# EAGLE design ptvo_fs (EAGLE 9.6.2)
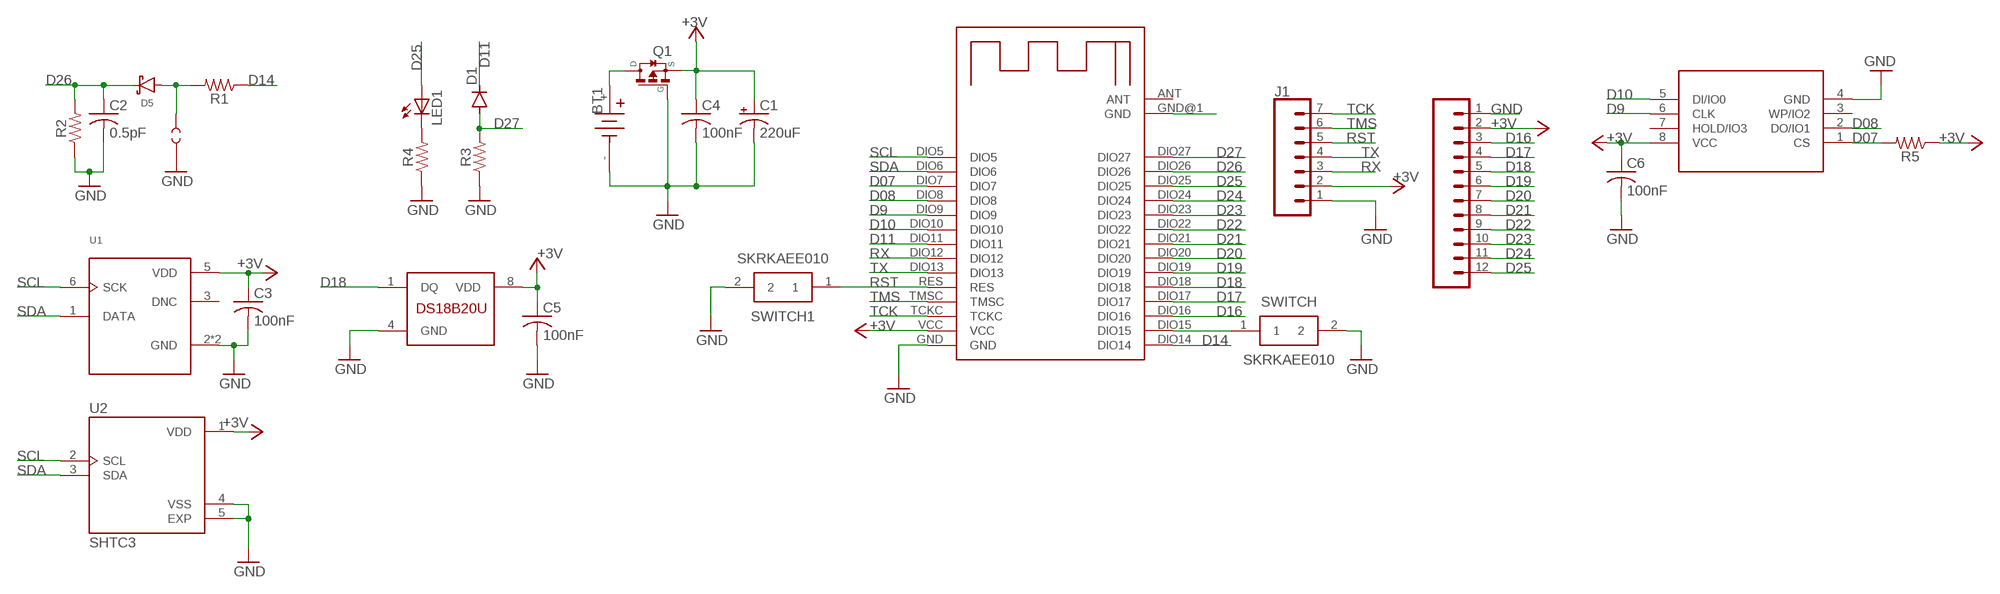
[diagram p0: schematic, sheet 1]

## Parts
BT1  BH2AAAPC  [BAT_BH2AAAPC]
C1  220uF  100UF-POLAR-EIA7343-10V-10%(TANT)  [EIA7343]
C2  0.5pF  C-USC0805  [C0805]
C3  100nF  C-USC0805  [C0805]
C4  100nF  C-USC0805  [C0805]
C5  100nF  C-USC0805  [C0805]
C6  100nF  C-USC0805  [C0805]
D1  PTSMD3528  DIODE-DO214BA  [DO214BA]
D5  1N4148WS  DIODE-SCHOTTKY  [SOD-323]
IC1  DS18S20USOP8  [UMAX8]
J1  CONN_051.27MM  [1X05_1.27MM]
J2  CONN_051.27MM  [1X05_1.27MM]
LED1  LEDCHIP-LED0805  [CHIP-LED0805]
Q1  SI2323DS  [SOT23]
R1  10k  R-US_M0805  [M0805]
R2  1M  R-US_M0805  [M0805]
R3  10k  R-US_M0805  [M0805]
R4  2.2k  R-US_M0805  [M0805]
R5  2.2k  R-US_M0805  [M0805]
SWITCH  SKRKAEE010  [SKRK]
SWITCH1  SKRKAEE010  [SKRK]
TP1  TEST-POINT2  [PAD.02X.02]
TP2  TEST-POINT2  [PAD.02X.02]
U1  HTU21D  [QFN100P300X300X100-7N]
U2  SHTC3  [SON100P200X200X80-5N]
U$1  RF-BM-2652P2  [RF-BM-2652P2]
U$2  IS25LP080D  W25Q80BVSNIG  [SO-8]

## Nets
+3V3: C1.A(+) C3.1 C4.1 C5.1 C6.1 IC1.8(VDD) J1.2 J2.2 Q1.2(S) R5.1 U1.5(VDD) U2.1(VDD) U$1.VCC U$2.8(VCC) ; supply symbol labelled +3V
D07: R5.2 U$1.DIO7 U$2.1(CS)
D08: U$1.DIO8 U$2.2(DO/IO1)
D9: U$1.DIO9 U$2.6(CLK)
D10: U$1.DIO10 U$2.5(DI/IO0)
D11: D1.C U$1.DIO11
D14: R1.1 U$1.DIO14
D16: J2.3 U$1.DIO16
D17: J2.4 U$1.DIO17
D18: IC1.1(DQ) J2.5 U$1.DIO18
D19: J2.6 U$1.DIO19
D20: J2.7 U$1.DIO20
D21: J2.8 U$1.DIO21
D22: J2.9 U$1.DIO22
D23: J2.10 U$1.DIO23
D24: J2.11 U$1.DIO24
D25: J2.12 LED1.A U$1.DIO25
D26: C2.1 D5.C R2.2 U$1.DIO26
D27: D1.A R3.2 U$1.DIO27
GND: BT1.- C1.C(-) C2.2 C3.2 C4.2 C5.2 C6.2 IC1.4(GND) J1.1 J2.1 Q1.1(G) R2.1 R3.1 R4.1 SWITCH1.2 SWITCH.2 TP2.P$1 U1.2(GND) U1.PAD(GND) U2.4(VSS) U2.5(EXP) U$1.GND U$2.4(GND)
N$1: D5.A R1.2 TP1.P$1
N$2: LED1.C R4.2
N$3: SWITCH.1 U$1.DIO15
N$5: BT1.+ Q1.3(D)
N$13: U$1.GND@1(GND)
RST: J1.5 SWITCH1.1 U$1.RES
RX: J1.3 U$1.DIO12
SCL: U1.6(SCK) U2.2(SCL) U$1.DIO5
SDA: U1.1(DATA) U2.3(SDA) U$1.DIO6
TCK: J1.7 U$1.TCKC
TMS: J1.6 U$1.TMSC
TX: J1.4 U$1.DIO13
Unconnected: U1.3(DNC) U$1.ANT U$2.3(WP/IO2) U$2.7(HOLD/IO3)

## Library data of the parts
BT1 = BH2AAAPC:BH2AAAPC: BATTERY HOLDER AAA 2 CELL PC PIN Check availability <https://pricing.snapeda.com/parts/BH2AAAPC/MPD%20%28Memory/view-part?ref=eda>; AVAILABILITY: In Stock; CHECK_PRICES: https://www.snapeda.com/parts/BH2AAAPC/MPD+%2528Memory+Protection+Devices%2529/view-part/?ref=eda; DESCRIPTION: 2 AAA cell holder w/ PC pins nylon plastic; MF: MPD (Memory; MP: BH2AAAPC; PACKAGE: None; PRICE: None; PURCHASE-URL: https://www.snapeda.com/api/url_track_click_mouser/?unipart_id=115930&manufacturer=MPD (Memory&part_name=BH2AAAPC&search_term=aaa battery holder; SNAPEDA_LINK: https://www.snapeda.com/parts/BH2AAAPC/MPD+%2528Memory+Protection+Devices%2529/view-part/?ref=snap
C1 = SparkFun-Capacitors:100UF-POLAR: 100µF polarized capacitors A capacitor is a passive two-terminal electrical component used to store electrical energy temporarily in an electric field.; PROD_ID: CAP-07890; VALUE: 100uF
C2-C6 = adafruit2:C-US: CAPACITOR, American symbol
D1 = diode:DIODE-: DIODE
D5 = pimoroni-passives:DIODE-SCHOTTKY
IC1 = 1wire:DS18S20: High Precision Digital Thermometer This chip provides a onewire thermosensor with approx. 0.5°C accuracy.A programmable over/undertemperure alarm is available. Notes: Vdd must be applied for accurate measurements at low temperatures, as the parasite power circuit otherwise heats the sensor. If parasite power is used, Vdd has to be connected to GND. The DS1822 is a low-cost thermometer chip, the DS18B20 is similar to the DS18S20, but with 9..12 Bit programmable precision. Author: Jan Kandziora <jjj@gmx.de>
J1 = SparkFun-Connectors2:CONN_05: Multi connection point. Often used as Generic Header-pin footprint for 0.1 inch spaced/style header connections On any of the 0.1 inch spaced packages, you can populate with these: Break Away Headers - Straight <https://www.sparkfun.com/products/116> (PRT-00116) Break Away Male Headers - Right Angle <https://www.sparkfun.com/products/553> (PRT-00553) Female Headers <https://www.sparkfun.com/products/115> (PRT-00115) Break Away Headers - Machine Pin <https://www.sparkfun.com/products/117> (PRT-00117) Break Away Female Headers - Swiss Machine Pin <https://www.sparkfun.com/products/743> (PRT-00743) For SCREWTERMINALS and SPRING TERMINALS visit here: Screw Terimnals on SparkFun.com <https://www.sparkfun.com/search/results?term=Screw+Terminals> (5mm/3.5mm/2.54mm spacing) This device is also useful as a general connection point to wire up your design to another part of your project. Our various solder wires solder well into these plated through hole pads. Hook-Up Wire - Assortment (Stranded, 22 AWG) <https://www.sparkfun.com/products/11375> (PRT-11375) Hook-Up Wire - Assortment (Solid Core, 22 AWG) <https://www.sparkfun.com/products/11367> (PRT-11367) View the entire wire category on our website here <https://www.sparkfun.com/categories/141> Special notes: Molex polarized connector foot print use with SKU : PRT-08231 with associated crimp pins and housings. 1MM SMD Version SKU: PRT-10208
J2 = SparkFun-Connectors:CONN_05: Multi connection point. Often used as Generic Header-pin footprint for 0.1 inch spaced/style header connections On any of the 0.1 inch spaced packages, you can populate with these: Break Away Headers - Straight <https://www.sparkfun.com/products/116> (PRT-00116) Break Away Male Headers - Right Angle <https://www.sparkfun.com/products/553> (PRT-00553) Female Headers <https://www.sparkfun.com/products/115> (PRT-00115) Break Away Headers - Machine Pin <https://www.sparkfun.com/products/117> (PRT-00117) Break Away Female Headers - Swiss Machine Pin <https://www.sparkfun.com/products/743> (PRT-00743) For SCREWTERMINALS and SPRING TERMINALS visit here: Screw Terimnals on SparkFun.com <https://www.sparkfun.com/search/results?term=Screw+Terminals> (5mm/3.5mm/2.54mm spacing) This device is also useful as a general connection point to wire up your design to another part of your project. Our various solder wires solder well into these plated through hole pads. Hook-Up Wire - Assortment (Stranded, 22 AWG) <https://www.sparkfun.com/products/11375> (PRT-11375) Hook-Up Wire - Assortment (Solid Core, 22 AWG) <https://www.sparkfun.com/products/11367> (PRT-11367) View the entire wire category on our website here <https://www.sparkfun.com/categories/141> Special notes: Molex polarized connector foot print use with SKU : PRT-08231 with associated crimp pins and housings. 1MM SMD Version SKU: PRT-10208
LED1 = adafruit:LED: LED OSRAM: - CHIPLED LG R971, LG N971, LY N971, LG Q971, LY Q971, LO R971, LY R971 LH N974, LH R974 LS Q976, LO Q976, LY Q976 LO Q996 - Hyper CHIPLED LW Q18S LB Q993, LB Q99A, LB R99A - SideLED LS A670, LO A670, LY A670, LG A670, LP A670 LB A673, LV A673, LT A673, LW A673 LH A674 LY A675 LS A676, LA A676, LO A676, LY A676, LW A676 LS A679, LY A679, LG A679 - Hyper Micro SIDELED® LS Y876, LA Y876, LO Y876, LY Y876 LT Y87S - SmartLED LW L88C, LW L88S LB L89C, LB L89S, LG L890 LS L89K, LO L89K, LY L89K LS L896, LA L896, LO L896, LY L896 - TOPLED LS T670, LO T670, LY T670, LG T670, LP T670 LSG T670, LSP T670, LSY T670, LOP T670, LYG T670 LG T671, LOG T671, LSG T671 LB T673, LV T673, LT T673, LW T673 LH T674 LS T676, LA T676, LO T676, LY T676, LB T676, LH T676, LSB T676, LW T676 LB T67C, LV T67C, LT T67C, LS T67K, LO T67K, LY T67K, LW E67C LS E67B, LA E67B, LO E67B, LY E67B, LB E67C, LV E67C, LT E67C LW T67C LS T679, LY T679, LG T679 LS T770, LO T770, LY T770, LG T770, LP T770 LB T773, LV T773, LT T773, LW T773 LH T774 LS E675, LA E675, LY E675, LS T675 LS T776, LA T776, LO T776, LY T776, LB T776 LHGB T686 LT T68C, LB T68C - Hyper Mini TOPLED® LB M676 - Mini TOPLED Santana® LG M470 LS M47K, LO M47K, LY M47K Source: http://www.osram.convergy.de/
Q1 = SI2323DS:SI2323DS: P-Channel MOSFET; AVAILABILITY: Unavailable; DESCRIPTION: P-Channel 20V 3.7A (Ta) 750mW (Ta) Surface Mount SOT-23-3 (TO-236); MF: Vishay Siliconix; MP: SI2323DS; PACKAGE: SOT-23-3 Vishay Siliconix; PRICE: None
R1-R5 = adafruit4:R-US_: RESISTOR, American symbol
SWITCH SWITCH1 = SPST Round Button:SKRKAEE010: Tactile Switches 3.9x2.9x2.0mm 160gf Packaging Temp 60oC <https://componentsearchengine.com/Images/1/SKRKAEE010.jpg> Source: Datasheet <http://www.mouser.com/ds/2/15/SKRK-1110686.pdf> Check availability <https://pricing.snapeda.com/parts/SKRKAEE010/ALPS/view-part?ref=eda>; AVAILABILITY: Not in stock; CHECK_PRICES: https://www.snapeda.com/parts/SKRKAEE010/ALPS/view-part/?ref=eda; DESCRIPTION: Switch Tactile N.O. SPST Round Button Gull Wing 0.05A 12VDC 1.57N SMD T/R; MF: ALPS; MP: SKRKAEE010; PACKAGE: None; PRICE: None; SNAPEDA_LINK: https://www.snapeda.com/parts/SKRKAEE010/ALPS/view-part/?ref=snap
TP1 TP2 = SparkFun-Connectors:TEST-POINT: SparkFun Test Points Bare copper test points for troubleshooting or In-Circuit-Testing. These are used by our Production team for verifying production board runs using pogo-pins on test beds. SparkFun Products: SparkFun LSM9DS1 Breakout <https://www.sparkfun.com/products/13284> SparkFun PSOC <https://www.sparkfun.com/products/13714> SparkFun Load Cell Amplifier <https://www.sparkfun.com/products/13879>
U1 = HTU21D:HTU21D: Digital Relative Humidity sensor with Temperature output Check prices <https://pricing.snapeda.com/parts/HTU21D/TE%20Connectivity/view-part?ref=eda>; AVAILABILITY: Warning; COMMENT: CAT-HSC0004; DESCRIPTION: Humidity Temperature Sensor 0 ~ 100% RH I²C ±2% RH 5s Surface Mount; MF: TE Connectivity; MP: HTU21D; PACKAGE: DFN-6 TE Connectivity; PRICE: None; PURCHASE-URL: https://pricing.snapeda.com/search/part/HTU21D/?ref=eda
U2 = SHTC3:SHTC3: SENSOR HUMI/TEMP I2C 2% SMD Check availability <https://pricing.snapeda.com/parts/SHTC3/Sensirion%20AG/view-part?ref=eda>; AVAILABILITY: In Stock; DESCRIPTION: SENSOR HUMI/TEMP I2C 2% SMD; MF: Sensirion AG; MP: SHTC3; PACKAGE: DFN-4 Sensirion; PRICE: None; PURCHASE-URL: https://pricing.snapeda.com/search/part/SHTC3/?ref=eda
U$1 = E72-2G4M20S1E:RF-BM-2652P2
U$2 = W25Q80BVSNIG:W25Q80BVSNIG: Check availability <https://pricing.snapeda.com/parts/W25Q80BVSNIG/Winbond%20Electronics/view-part?ref=eda>; AVAILABILITY: In Stock; DESCRIPTION: FLASH - NOR Memory IC 8Mb (1M x 8) SPI - Quad I/O 104 MHz 8-SOIC; MF: Winbond Electronics; MP: W25Q80BVSNIG; PACKAGE: SOIC-8 Winbond; PRICE: None

## Board
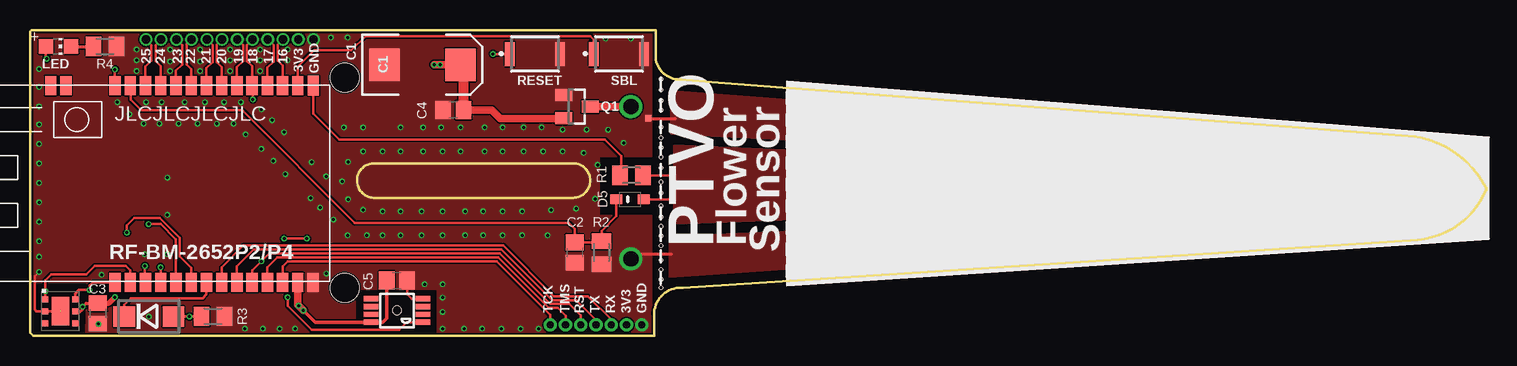
[diagram p1: board, top side]
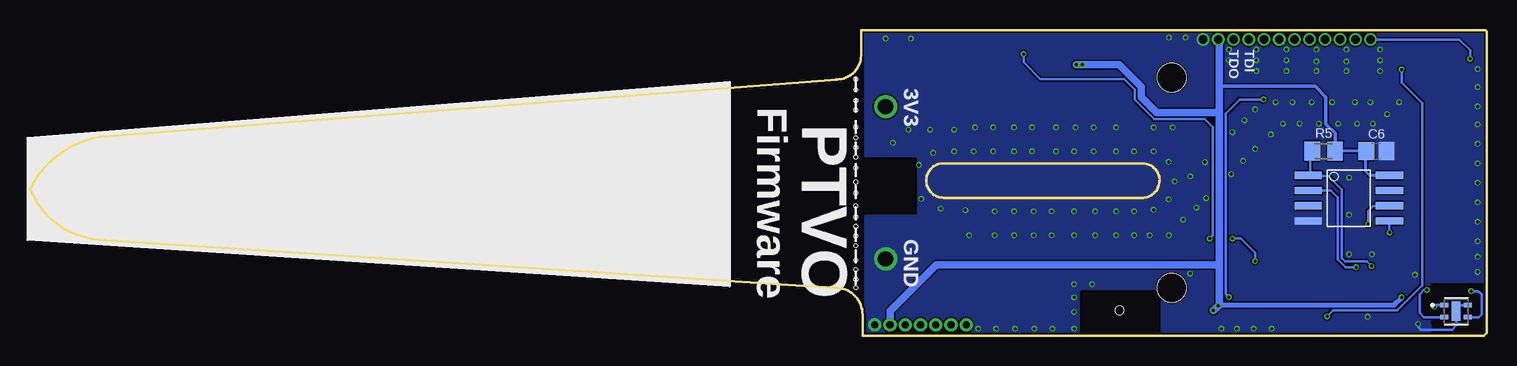
[diagram p2: board, bottom side, seen from below]

Size 121.38 x 25.5 mm. Coordinates in mm from the lower left corner, seen from the top.
Outline: 54.25,21.38 54.12,21.38
Outline: 54.12,21.38 arc-90 52.12,23.38 52.12,25.5 0.12,25.5 0,25.38 0,0.25 0.25,0 52,0 52,1.75 arc-90 54.25,4 54.38,4 115.62,8 arc64 121.38,12.25 arc55 115.38,16.62 54.12,21.38
Copper layers (1*16): Top 0.035559375mm / dielectric 0.17018125mm / Bottom 0.035559375mm
Design rules "oshpark-4layer *": minimum track width 6mil, minimum drill 0.2mm, track to track 5mil, track to pad 5mil, pad to pad 5mil, via to via 5mil, smd to smd 5mil, copper to edge 0.16mm, drill to drill 0.2mm, minimum pad ring 4mil, minimum via ring 4mil, stop-mask expansion 0.05588125mm, vias tented up to drill 50mil, thermal gap 10mil
Holes 0.3 mm at 52.58,4 52.58,4.7 52.58,5.5 52.58,6.3 52.58,7.5 52.58,8.3 52.58,9.1 52.58,9.9 52.58,10.8 52.58,11.9 52.58,12.8 52.58,14 52.58,14.9 52.58,15.7 52.58,16.5 52.58,17.4 52.58,18.8 52.58,19.6 52.58,20.5 52.58,21.4
Holes 0.7 mm at 30.58,2.1
Milling: 4 lines

### Footprints (pad centres in the part's own frame; a part is rotated, then mirrored left to right if it is on the bottom)
BAT_BH2AAAPC = drill 1.27: + 24.05,-6.35; - 24.05,6.35 | hole 2.37: 0.2,8.765; 0.2,-8.765
EIA7343 = smd 2.55 x 2.7: A 3.17,0; C -3.17,0
C0805 = smd 1.3 x 1.5: 1 -0.85,0; 2 0.85,0
DO214BA = smd 1.8 x 1.7: A 2.05,0; C -2.05,0
SOD-323 = smd 1 x 0.8: A 1.15,0; C -1.15,0
UMAX8 = smd 0.45 x 1.2: 1 -0.975,-2.175; 2 -0.325,-2.175; 3 0.325,-2.175; 4 0.975,-2.175; 5 0.975,2.175; 6 0.325,2.175; 7 -0.325,2.175; 8 -0.975,2.175
1X05_1.27MM = drill 0.6 pad 1.1: 1 0,0; 2 1.27,0; 3 2.54,0; 4 3.81,0; 5 5.08,0; 6 6.35,0; 7 7.62,0
1X05_1.27MM' = drill 0.7 pad 1: 1 0,0; 2 1.27,0; 3 2.54,0; 4 3.81,0; 5 5.08,0; 6 6.35,0; 7 7.62,0; 8 8.89,0; 9 10.16,0; 10 11.43,0; 11 12.7,0; 12 13.97,0
CHIP-LED0805 = smd 1.2 x 1.2: A 0,-1.05; C 0,1.05
SOT23 = smd 1 x 1.4: 1 -0.95,-1.1; 2 0.95,-1.1; 3 0,1.1
M0805 = smd 1.3 x 1.6: 1 -0.95,0; 2 0.95,0
SKRK = smd 0.8 x 2: 1 -2.1,0; 2 2.1,0
PAD.02X.02 = smd 0.508 x 0.508: P$1 0,0
QFN100P300X300X100-7N = smd 0.5 x 0.5: 1 -1.25,1; 2 -1.25,0; 3 -1.25,-1; 4 1.25,-1; 5 1.25,0; 6 1.25,1 | smd 1.45 x 2.4: PAD 0.013,0.002
SON100P200X200X80-5N = smd 0.75 x 0.35: 1 -0.97,0.5; 2 -0.97,-0.5; 3 0.97,-0.5; 4 0.97,0.5 | smd 0.7 x 1.6: 5 0,0
RF-BM-2652P2 = smd 1.6 x 0.94: ANT 16.346,23.27; DIO5 -0.073,17.91; DIO6 -0.073,16.64; DIO7 -0.073,15.37; DIO8 -0.073,14.1; DIO9 -0.073,12.83; DIO10 -0.073,11.56; DIO11 -0.073,10.29; DIO12 -0.073,9.02; DIO13 -0.073,7.75; DIO14 16.346,1.4; DIO15 16.346,2.67; DIO16 16.346,3.94; DIO17 16.346,5.21; DIO18 16.346,6.48; DIO19 16.346,7.75; DIO20 16.346,9.02; DIO21 16.346,10.29; DIO22 16.346,11.56; DIO23 16.346,12.83; DIO24 16.346,14.1; DIO25 16.346,15.37; DIO26 16.346,16.64; DIO27 16.346,17.91; GND -0.073,1.4; GND@1 16.346,22; RES -0.073,6.48; TCKC -0.073,3.94; TMSC -0.073,5.21; VCC -0.073,2.67
SO-8 = smd 2.286 x 0.61: 1 -3.378,1.27; 2 -3.378,0; 3 -3.378,-1.27; 4 -3.378,-2.54; 5 3.378,-2.54; 6 3.378,-1.27; 7 3.378,0; 8 3.378,1.27

### Placement (x,y rotation side)
BT1  26.03,12.75 180 bottom
C1  32.7,22.6 0 top
C2  45.38,6.92 270 top
C3  5.65,1.85 270 top
C4  35.27,18.8 180 top
C5  30.58,4.6 0 top
C6  9.17,15.4 0 bottom
D1  9.9,1.6 0 top
D5  50,11.38 0 top
IC1  30.58,2.1 90 top
J1  50.98,0.9 180 top
J2  [1X05_1.27MM']  23.62,24.7 180 top
LED1  2.38,24.12 270 top
Q1  45.58,19.1 270 top
R1  50.12,13.38 0 top
R2  47.62,6.92 90 top
R3  15.25,1.6 180 top
R4  6.25,24.12 180 top
R5  13.57,15.4 180 bottom
SWITCH  49.08,23.5 0 top
SWITCH1  42.08,23.5 0 top
TP1  51.25,13.38 0 top
TP2  51.52,18.12 0 top
U1  2.52,2.04 0 top
U2  2.54,2.04 0 bottom
U$1  24.99,4.51 90 top
U$2  11.47,12.1 0 bottom

### Tracks (layer width: path | path; a pad name or v marks a point on that pad's centre or on a via)
+3V3  (via drill 0.25)
  Top 0.254: C3.1 4.67,2.7 v4.38,2.4 4.38,2.2 4.22,2.04 U1.5
  Top 0.305: v22.78,2.1 23.75,1.12 IC1.8 28.43,1.1 29.38,1.1 29.73,1.45 C5.1
  Top 0.406: C3.1 6.57,2.7 v7.07,3.2
  Top 0.61: Q1.2 44.43,18.1 39.18,18.1 38.48,18.8 C4.1 | C1.A 36.18,22.3 | C1.A v34.18,22.6 v33.68,22.6 | U$1.VCC 22.32,2.55 v22.38,2.5 v22.78,2.1 | C1.A 36.12,22.35
  Top 0.813: C4.1 36.12,22.75 36.27,22.9 36.18,22.9 C1.A
  Bottom 0.254: R5.1 C6.1 10.07,15.35 10.07,13.7 9.74,13.37 U$2.8 | U2.1 4.24,2.54 v4.38,2.4
  Bottom 0.305: R5.1 12.62,16.91 13.38,17.66 13.38,19.91 14.28,20.8 22.28,20.8
  Bottom 0.406: v22.38,2.5 22.32,2.55 7.72,2.55 v7.07,3.2
  Bottom 0.61: J2.2 22.28,24.62 22.28,20.8 22.28,18.7 | 22.28,5.9 22.28,2.58 22.75,2.1 v22.78,2.1 | 22.28,5.9 22.28,18.7 | 22.28,18.7 22.38,18.6 27.48,18.6 28.78,19.9 28.78,20.75 30.62,22.6 v34.18,22.6 | 22.28,5.9 45.88,5.9 49.7,2.07 J1.2
D07  (via drill 0.25)
  Top 0.2: U$1.DIO7 9.57,4.49 v9.57,5.8
  Bottom 0.2: v9.57,5.8 9.97,6.2 11.78,6.2 12.07,6.5 12.07,12.2 13.17,13.3 14.67,13.3 | U$2.1 14.78,13.3 14.67,13.3 | R5.2 14.67,15.25 14.67,13.3
D08  (via drill 0.25)
  Top 0.2: U$1.DIO8 10.89,5.68 v10.88,5.7
  Bottom 0.2: v10.88,5.7 11.74,5.7 12.4,6.37 12.4,11.53 12.97,12.1 U$2.2
D9  (via drill 0.25)
  Top 0.2: U$1.DIO9 12.16,8.01 10.88,9.3 v9.88,9.3
  Bottom 0.2: U$2.6 9.45,10.83 9.88,10.4 v9.88,9.3
D10  (via drill 0.25)
  Top 0.2: U$1.DIO10 13.43,5.64 12.49,6.59 12.49,8.15 10.81,9.83 8.7,9.83 8.07,9.2 v8.07,8.6
  Bottom 0.2: U$2.5 8.1,8.62 v8.07,8.6
D11
  Top 0.203: D1.C 7.85,2.58 8.38,3.1 14.38,3.1 14.7,3.43 U$1.DIO11
D14
  Top 0.2: R1.1 49.25,13.45 49.25,15 47.88,16.38 25.75,16.38 23.59,18.53 U$1.DIO14
D16
  Top 0.2: U$1.DIO16 21.05,22.52 20.65,22.93 20.65,24.27 J2.3
D17
  Top 0.2: U$1.DIO17 19.78,22.36 20.3,22.88 20.3,24.21 J2.4
D18  (via drill 0.25)
  Top 0.2: J2.5 18.08,24.23 18.08,22.9 18.51,22.46 U$1.DIO18 18.58,20.8 v18.58,19.7 | v21.48,3.2 21.48,2.5 23.48,0.5 30.78,0.5 31.4,1.12 IC1.1
  Bottom 0.2: v18.58,19.7 20.58,19.7 21.74,18.53 21.74,3.47 v21.48,3.2
D19
  Top 0.2: U$1.DIO19 17.24,22.39 17.75,22.9 17.75,24.23 J2.6
D20
  Top 0.2: U$1.DIO20 15.97,22.4 15.58,22.8 15.58,24.27 J2.7
D21
  Top 0.2: U$1.DIO21 14.7,22.3 15.22,22.82 15.22,24.21 J2.8
D22
  Top 0.2: 13.07,22.6 13.07,24.31 J2.9
  Top 0.203: U$1.DIO22 13.43,22.24 13.07,22.6
D23
  Top 0.2: 12.67,22.6 12.67,24.22 J2.10
  Top 0.203: U$1.DIO23 12.16,22.09 12.67,22.6
D24
  Top 0.2: 10.47,22.9 10.47,24.25 J2.11
  Top 0.203: U$1.DIO24 10.89,22.48 10.47,22.9
D25  (via drill 0.25)
  Top 0.2: U$1.DIO25 9.62,22.45 10.11,22.93 10.11,24.25 J2.12 | LED1.A 1.33,23.15 v1.38,23.1
  Bottom 0.2: v1.38,23.1 1.38,23.8 2.27,24.7 J2.12
D26
  Top 0.2: 48.83,11.4 D5.C 48.85,9.97 47.62,8.75 R2.2 47.52,7.78 C2.1 45.38,8.9 44.88,9.4 27.08,9.4 17.68,18.8 9.28,18.8 8.38,19.7 8.38,20.84 U$1.DIO26
D27  (via drill 0.25)
  Top 0.2: U$1.DIO27 v7.07,22.2
  Top 0.203: R3.2 v13.28,1.6 D1.A
  Bottom 0.203: v7.07,22.2 7.07,21.1 5.38,19.4 5.38,4.2 7.46,2.12 12.76,2.12 v13.28,1.6
GND  (via drill 0.25)  (1 unrouted)
  Top 0.2: IC1.4 31.8,3.08 31.43,3.45 C5.2 | v0.75,5.3 0.38,4.92 0.38,2.2 0.53,2.04 U1.2 U1.PAD U2.5
  Top 0.254: 53.77,18.1 53.75,18.12 TP2.P$1 | BT1.- 50.48,6.8 53.48,6.8
  Bottom 0.2: U2.4 2.34,2.54 2.54,2.34 U2.5 | U2.5 2.44,1.94 U2.5 | U2.5 2.54,0.84 2.88,0.5 5.47,0.5 5.7,0.73 v5.7,0.98
  other vias: 29.38,10.38 30.88,10.38 32.62,10.38 34.38,10.38 36.25,10.38 37.75,10.38 39.38,10.38 41,10.38 43.43,10.47 27.75,10.5 26.5,11.38 26,12.88 26.5,14.5 27.75,15.38 29.38,15.38 30.88,15.38 32.75,15.38 34.38,15.38 35.88,15.38 37.88,15.38 39.38,15.38 41.12,15.38 42.75,15.38 44.38,15.38 46.12,15.25 47.3,14.25 47.1,11.4 45.5,10.6 27.75,17.38 30.88,17.38 32.75,17.38 34.25,17.38 35.88,17.38 37.88,17.38 39.38,17.38 41.12,17.38 42.62,17.38 44.38,17.18 0.75,6.58 0.75,7.88 0.75,9.5 0.75,11.12 0.75,12.75 0.75,14.38 0.75,16 0.75,17.62 0.75,19.12 0.75,20.75 0.75,22.25 29.38,8.38 30.88,8.38 32.62,8.38 34.38,8.38 36.25,8.38 37.75,8.38 39.38,8.38 41,8.38 43.12,8.38 28.08,8.38 26.48,8.38 25.28,9.68 24.18,10.68 21.28,13.47 20.28,14.57 19.28,15.57 17.98,16.77 16.98,17.68 15.58,17.68 13.97,17.68 12.38,17.68 10.78,17.68 7.27,19.48 20.18,17.98 19.28,18.88 17.58,19.48 14.57,19.48 12.88,19.48 10.97,19.48 21.18,16.98 23.48,14.47 24.68,13.28 23.38,11.47 16.18,19.48 9.47,17.68 8.28,18.48 26.15,17.38 46.38,17.18 48.18,17.18 49.48,16.07 11.67,23.88 11.67,22.88 14.17,23.88 14.17,22.88 16.68,23.88 19.18,23.88 16.68,22.98 19.18,22.98 21.48,23.88 19.18,22.07 16.68,22.07 14.17,22.07 11.67,22.07 8.88,23.88 8.88,22.07 25.08,24.88 26.48,24.88 21.48,22.98 40.88,0.57 9.67,19.48 8.88,22.98 11.45,13.18 11.45,10.07 11.45,6.78 9.55,6.78 39.27,0.57 37.68,0.57 36.18,0.57 34.38,0.57 5.97,5.08 22.1,0.57 20.8,0.57 19.4,0.57 17.9,0.57 34.38,1.98 34.38,3.17 34.38,4.28 24.7,5.17 9.9,1.58 32.88,4.28 42.38,0.57 47.98,24.77 50.08,24.77
  pour Top: 53.38,16.88 116,13.75 arc-169 116.12,11 53.25,8.25 53.25,4.89 115.8,9.21 arc160 116.49,15.58 53.38,20.41
  pour Top (no thermals): 51.18,18.4 51.18,17.6 51.77,17.6 51.77,18.4
  pour Top (no thermals): 4.78,4.5 -0.23,4.5 -0.23,25.7 51.77,25.7 51.77,15 47.38,15 47.38,10 51.77,10 51.77,-0.2 33.98,-0.2 33.98,3.9 27.08,3.9 27.08,-0.21 4.68,-0.21
  pour Bottom (no thermals): 4.79,4.48 -0.43,4.48 -0.43,25.7 51.77,25.7 51.77,15 47.38,15 47.38,10 51.77,10 51.77,-0.4 33.98,-0.4 33.98,3.9 27.08,3.9 27.08,-0.2 4.69,-0.2
N$1
  Top 0.2: 51.33,11.55 D5.A
  Top 0.203: R1.2 53.75,13.38 53.75,11.38 D5.A
  Top 0.254: 51.15,13.3 R1.2 TP1.P$1
  pour Top: 53.62,15.88 53.62,9.38 115.77,11.64 arc168 115.87,13.08
N$2
  Top 0.254: LED1.C R4.2
N$3
  Top 0.2: U$1.DIO15 22.32,22.45 23.68,23.8 26.78,23.8 27.98,25 46.68,25 46.98,24.7 SWITCH.1
N$5
  Top 0.61: Q1.3 BT1.+
RST  (via drill 0.25)
  Top 0.2: SWITCH1.1 v38.58,23.5 | U$1.RES 18.51,5.44 v19.28,6.2 19.93,6.85 39.15,6.85 43.37,2.63 44.95,2.63 45.9,1.68 J1.5 | v23.08,8.1 v21.18,8.1
  Bottom 0.2: v23.08,8.1 22.81,8.37 22.81,17.4 23.48,18.07 27.7,18.07 29.31,19.68 29.31,20.53 30.18,21.4 37.18,21.4 38.58,22.8 v38.58,23.5 | v19.28,6.2 19.28,6.9 20.48,8.1 v21.18,8.1
RX
  Top 0.2: U$1.DIO12 15.97,5.7 17.78,7.51 39.42,7.51 43.64,3.28 46.49,3.28 48.44,1.34 J1.3
SCL  (via drill 0.25)
  Top 0.2: U$1.DIO5 7.06,4.46 | 7.02,4.5 U$1.DIO5 | U1.6 3.77,3.49 4.07,3.8 v4.97,3.8 4.97,4.2 5.22,4.44 U$1.DIO5
  Bottom 0.2: U2.2 5.21,1.54 5.57,1.9 5.57,3.43 5.21,3.8 v4.97,3.8
SDA  (via drill 0.25)
  Top 0.2: U$1.DIO6 8.35,5.42 7.97,5.8 5.38,5.8 4.67,5.1 1.77,5.1 1.27,4.6 v1.27,3.7 v1.27,3.69 U1.1
  Top 0.254: 8.38,4.46 U$1.DIO6
  Bottom 0.2: v1.27,3.7 0.69,3.7 0.41,3.42 0.41,1.76 0.64,1.54 U2.3
TCK
  Top 0.2: U$1.TCKC 21.05,5.78 21.48,6.2 38.88,6.2 43.36,1.72 J1.7
TMS
  Top 0.2: U$1.TMSC 19.78,5.71 20.6,6.53 39.01,6.53 43.24,2.3 43.98,2.3 44.62,1.65 J1.6
  Top 0.203: U$1.TMSC
TX
  Top 0.2: U$1.DIO13 17.24,5.77 18.66,7.18 39.28,7.18 43.51,2.95 45.52,2.95 47.16,1.31 J1.4

### Text on the board
tNames: LED | 25 | 24 | 23 | 22 | 21 | 20 | 19 | 18 | 17 | 16 | C1 | 3V3 | GND | RESET | SBL | JLCJLCJLCJLC | PTVO | Flower | Sensor | RF-BM-2652P2/P4 | . | TCK | TMS | RST | TX | RX | 3V3 | GND
bNames: TDI | TDO | 3V3 | Firmware | PTVO | GND